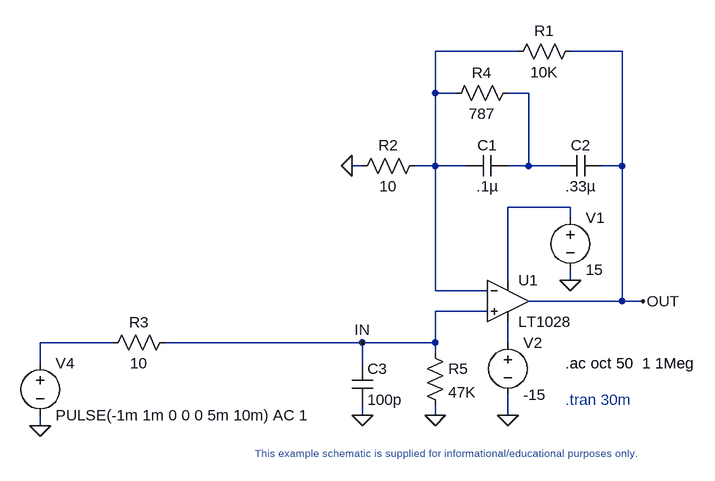
[diagram p0: schematic phono.asc]
phono.asc, the LTspice schematic file:
Version 4
SHEET 1 2060 1608
WIRE 1120 848 992 848
WIRE 1280 848 1200 848
WIRE 992 912 992 848
WIRE 1024 912 992 912
WIRE 1136 912 1104 912
WIRE 880 1024 864 1024
WIRE 992 1024 992 912
WIRE 992 1024 960 1024
WIRE 1040 1024 992 1024
WIRE 1136 1024 1136 912
WIRE 1136 1024 1104 1024
WIRE 1184 1024 1136 1024
WIRE 1280 1024 1280 848
WIRE 1280 1024 1248 1024
WIRE 1200 1088 1104 1088
WIRE 1200 1104 1200 1088
WIRE 1104 1200 1104 1088
WIRE 1200 1200 1200 1184
WIRE 992 1216 992 1024
WIRE 1072 1216 992 1216
WIRE 1280 1232 1280 1024
WIRE 1280 1232 1136 1232
WIRE 1312 1232 1280 1232
WIRE 1072 1248 992 1248
WIRE 496 1296 384 1296
WIRE 880 1296 576 1296
WIRE 992 1296 992 1248
WIRE 992 1296 880 1296
WIRE 1104 1296 1104 1264
WIRE 992 1312 992 1296
WIRE 384 1328 384 1296
WIRE 880 1328 880 1296
WIRE 880 1408 880 1392
WIRE 992 1408 992 1392
WIRE 1104 1408 1104 1376
WIRE 384 1424 384 1408
FLAG 1200 1200 0
FLAG 1104 1408 0
FLAG 384 1424 0
FLAG 864 1024 0
FLAG 992 1408 0
FLAG 880 1408 0
FLAG 880 1296 IN
FLAG 1312 1232 OUT
SYMBOL cap 1104 1008 R90
WINDOW 0 0 32 VBottom 2
WINDOW 3 32 32 VTop 2
SYMATTR InstName C1
SYMATTR Value .1µ
SYMBOL cap 1248 1008 R90
WINDOW 0 0 32 VBottom 2
WINDOW 3 32 32 VTop 2
SYMATTR InstName C2
SYMATTR Value .33µ
SYMBOL res 1216 832 R90
WINDOW 0 0 56 VBottom 2
WINDOW 3 32 56 VTop 2
SYMATTR InstName R1
SYMATTR Value 10K
SYMBOL res 976 1008 R90
WINDOW 0 0 56 VBottom 2
WINDOW 3 32 56 VTop 2
SYMATTR InstName R2
SYMATTR Value 10
SYMBOL res 592 1280 R90
WINDOW 0 0 56 VBottom 2
WINDOW 3 32 56 VTop 2
SYMATTR InstName R3
SYMATTR Value 10
SYMBOL res 1120 896 R90
WINDOW 0 0 56 VBottom 2
WINDOW 3 32 56 VTop 2
SYMATTR InstName R4
SYMATTR Value 787
SYMBOL cap 864 1328 R0
SYMATTR InstName C3
SYMATTR Value 100p
SYMBOL res 976 1296 R0
SYMATTR InstName R5
SYMATTR Value 47K
SYMBOL voltage 1200 1088 R0
SYMATTR InstName V1
SYMATTR Value 15
SYMBOL voltage 1104 1280 R0
SYMATTR InstName V2
SYMATTR Value -15
SYMBOL voltage 384 1312 R0
SYMATTR InstName V4
SYMATTR Value PULSE(-1m 1m 0 0 0 5m 10m) AC 1
SYMBOL OPAMPS\\LT1028 1104 1168 R0
SYMATTR InstName U1
TEXT 1192 1384 Left 2 ;.tran 30m
TEXT 1192 1328 Left 2 !.ac oct 50  1 1Meg
TEXT 1000 1456 Top 1 ;This example schematic is supplied for informational/educational purposes only.

The netlist it stands for:
* phono.asc
C1 N002 N001 .1µ
C2 OUT N002 .33µ
R1 OUT N001 10K
R2 N001 0 10
R3 IN N004 10
R4 N002 N001 787
C3 IN 0 100p
R5 IN 0 47K
V1 N003 0 15
V2 N005 0 -15
V4 N004 0 PULSE(-1m 1m 0 0 0 5m 10m) AC 1
XU1 IN N001 N003 N005 OUT LT1028  ; pins In+ In- V+ V- OUT
* .tran 30m
.ac oct 50  1 1Meg
* This example schematic is supplied for informational/educational purposes only.
.lib LTC.lib
.backanno
.end